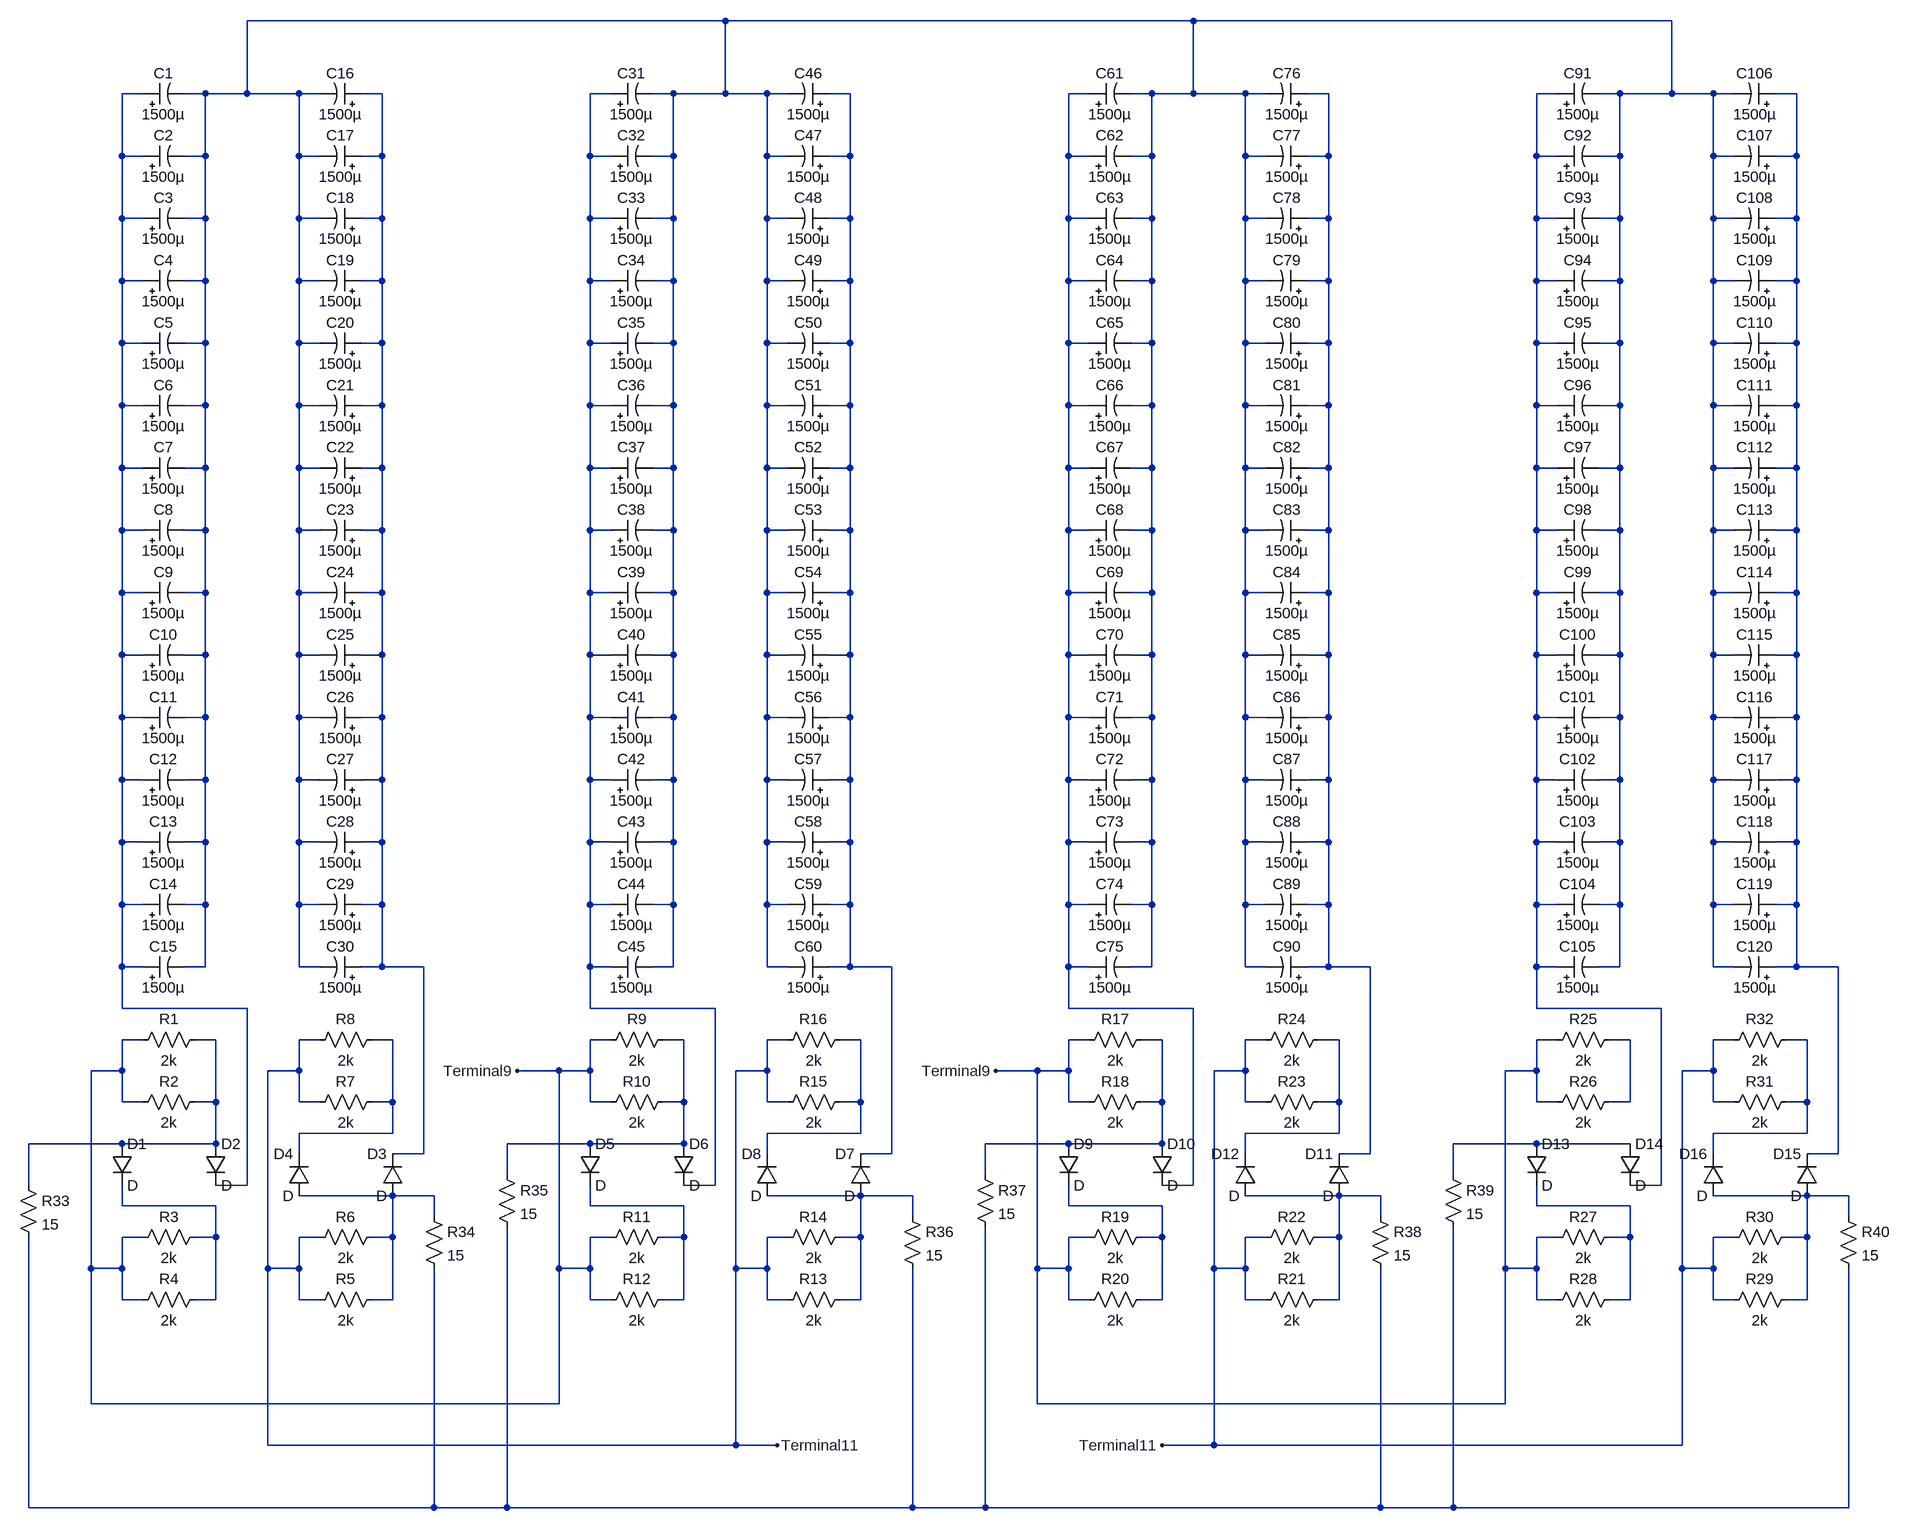
[diagram p0: schematic CapBank1_15CapSide_1to1.asc]
CapBank1_15CapSide_1to1.asc, the LTspice schematic file:
Version 4
SHEET 1 2772 2280
WIRE 976 -16 240 -16
WIRE 1696 -16 976 -16
WIRE 2432 -16 1696 -16
WIRE 80 96 48 96
WIRE 176 96 144 96
WIRE 240 96 240 -16
WIRE 240 96 176 96
WIRE 320 96 240 96
WIRE 352 96 320 96
WIRE 448 96 416 96
WIRE 800 96 768 96
WIRE 896 96 864 96
WIRE 976 96 976 -16
WIRE 976 96 896 96
WIRE 1040 96 976 96
WIRE 1072 96 1040 96
WIRE 1168 96 1136 96
WIRE 1536 96 1504 96
WIRE 1632 96 1600 96
WIRE 1696 96 1696 -16
WIRE 1696 96 1632 96
WIRE 1776 96 1696 96
WIRE 1808 96 1776 96
WIRE 1904 96 1872 96
WIRE 2256 96 2224 96
WIRE 2352 96 2320 96
WIRE 2432 96 2432 -16
WIRE 2432 96 2352 96
WIRE 2496 96 2432 96
WIRE 2528 96 2496 96
WIRE 2624 96 2592 96
WIRE 48 192 48 96
WIRE 80 192 48 192
WIRE 176 192 176 96
WIRE 176 192 144 192
WIRE 320 192 320 96
WIRE 352 192 320 192
WIRE 448 192 448 96
WIRE 448 192 416 192
WIRE 768 192 768 96
WIRE 800 192 768 192
WIRE 896 192 896 96
WIRE 896 192 864 192
WIRE 1040 192 1040 96
WIRE 1072 192 1040 192
WIRE 1168 192 1168 96
WIRE 1168 192 1136 192
WIRE 1504 192 1504 96
WIRE 1536 192 1504 192
WIRE 1632 192 1632 96
WIRE 1632 192 1600 192
WIRE 1776 192 1776 96
WIRE 1808 192 1776 192
WIRE 1904 192 1904 96
WIRE 1904 192 1872 192
WIRE 2224 192 2224 96
WIRE 2256 192 2224 192
WIRE 2352 192 2352 96
WIRE 2352 192 2320 192
WIRE 2496 192 2496 96
WIRE 2528 192 2496 192
WIRE 2624 192 2624 96
WIRE 2624 192 2592 192
WIRE 48 288 48 192
WIRE 80 288 48 288
WIRE 176 288 176 192
WIRE 176 288 144 288
WIRE 320 288 320 192
WIRE 352 288 320 288
WIRE 448 288 448 192
WIRE 448 288 416 288
WIRE 768 288 768 192
WIRE 800 288 768 288
WIRE 896 288 896 192
WIRE 896 288 864 288
WIRE 1040 288 1040 192
WIRE 1072 288 1040 288
WIRE 1168 288 1168 192
WIRE 1168 288 1136 288
WIRE 1504 288 1504 192
WIRE 1536 288 1504 288
WIRE 1632 288 1632 192
WIRE 1632 288 1600 288
WIRE 1776 288 1776 192
WIRE 1808 288 1776 288
WIRE 1904 288 1904 192
WIRE 1904 288 1872 288
WIRE 2224 288 2224 192
WIRE 2256 288 2224 288
WIRE 2352 288 2352 192
WIRE 2352 288 2320 288
WIRE 2496 288 2496 192
WIRE 2528 288 2496 288
WIRE 2624 288 2624 192
WIRE 2624 288 2592 288
WIRE 48 384 48 288
WIRE 80 384 48 384
WIRE 176 384 176 288
WIRE 176 384 144 384
WIRE 320 384 320 288
WIRE 352 384 320 384
WIRE 448 384 448 288
WIRE 448 384 416 384
WIRE 768 384 768 288
WIRE 800 384 768 384
WIRE 896 384 896 288
WIRE 896 384 864 384
WIRE 1040 384 1040 288
WIRE 1072 384 1040 384
WIRE 1168 384 1168 288
WIRE 1168 384 1136 384
WIRE 1504 384 1504 288
WIRE 1536 384 1504 384
WIRE 1632 384 1632 288
WIRE 1632 384 1600 384
WIRE 1776 384 1776 288
WIRE 1808 384 1776 384
WIRE 1904 384 1904 288
WIRE 1904 384 1872 384
WIRE 2224 384 2224 288
WIRE 2256 384 2224 384
WIRE 2352 384 2352 288
WIRE 2352 384 2320 384
WIRE 2496 384 2496 288
WIRE 2528 384 2496 384
WIRE 2624 384 2624 288
WIRE 2624 384 2592 384
WIRE 48 480 48 384
WIRE 80 480 48 480
WIRE 176 480 176 384
WIRE 176 480 144 480
WIRE 320 480 320 384
WIRE 352 480 320 480
WIRE 448 480 448 384
WIRE 448 480 416 480
WIRE 768 480 768 384
WIRE 800 480 768 480
WIRE 896 480 896 384
WIRE 896 480 864 480
WIRE 1040 480 1040 384
WIRE 1072 480 1040 480
WIRE 1168 480 1168 384
WIRE 1168 480 1136 480
WIRE 1504 480 1504 384
WIRE 1536 480 1504 480
WIRE 1632 480 1632 384
WIRE 1632 480 1600 480
WIRE 1776 480 1776 384
WIRE 1808 480 1776 480
WIRE 1904 480 1904 384
WIRE 1904 480 1872 480
WIRE 2224 480 2224 384
WIRE 2256 480 2224 480
WIRE 2352 480 2352 384
WIRE 2352 480 2320 480
WIRE 2496 480 2496 384
WIRE 2528 480 2496 480
WIRE 2624 480 2624 384
WIRE 2624 480 2592 480
WIRE 48 576 48 480
WIRE 80 576 48 576
WIRE 176 576 176 480
WIRE 176 576 144 576
WIRE 320 576 320 480
WIRE 352 576 320 576
WIRE 448 576 448 480
WIRE 448 576 416 576
WIRE 768 576 768 480
WIRE 800 576 768 576
WIRE 896 576 896 480
WIRE 896 576 864 576
WIRE 1040 576 1040 480
WIRE 1072 576 1040 576
WIRE 1168 576 1168 480
WIRE 1168 576 1136 576
WIRE 1504 576 1504 480
WIRE 1536 576 1504 576
WIRE 1632 576 1632 480
WIRE 1632 576 1600 576
WIRE 1776 576 1776 480
WIRE 1808 576 1776 576
WIRE 1904 576 1904 480
WIRE 1904 576 1872 576
WIRE 2224 576 2224 480
WIRE 2256 576 2224 576
WIRE 2352 576 2352 480
WIRE 2352 576 2320 576
WIRE 2496 576 2496 480
WIRE 2528 576 2496 576
WIRE 2624 576 2624 480
WIRE 2624 576 2592 576
WIRE 48 672 48 576
WIRE 80 672 48 672
WIRE 176 672 176 576
WIRE 176 672 144 672
WIRE 320 672 320 576
WIRE 352 672 320 672
WIRE 448 672 448 576
WIRE 448 672 416 672
WIRE 768 672 768 576
WIRE 800 672 768 672
WIRE 896 672 896 576
WIRE 896 672 864 672
WIRE 1040 672 1040 576
WIRE 1072 672 1040 672
WIRE 1168 672 1168 576
WIRE 1168 672 1136 672
WIRE 1504 672 1504 576
WIRE 1536 672 1504 672
WIRE 1632 672 1632 576
WIRE 1632 672 1600 672
WIRE 1776 672 1776 576
WIRE 1808 672 1776 672
WIRE 1904 672 1904 576
WIRE 1904 672 1872 672
WIRE 2224 672 2224 576
WIRE 2256 672 2224 672
WIRE 2352 672 2352 576
WIRE 2352 672 2320 672
WIRE 2496 672 2496 576
WIRE 2528 672 2496 672
WIRE 2624 672 2624 576
WIRE 2624 672 2592 672
WIRE 48 768 48 672
WIRE 80 768 48 768
WIRE 176 768 176 672
WIRE 176 768 144 768
WIRE 320 768 320 672
WIRE 352 768 320 768
WIRE 448 768 448 672
WIRE 448 768 416 768
WIRE 768 768 768 672
WIRE 800 768 768 768
WIRE 896 768 896 672
WIRE 896 768 864 768
WIRE 1040 768 1040 672
WIRE 1072 768 1040 768
WIRE 1168 768 1168 672
WIRE 1168 768 1136 768
WIRE 1504 768 1504 672
WIRE 1536 768 1504 768
WIRE 1632 768 1632 672
WIRE 1632 768 1600 768
WIRE 1776 768 1776 672
WIRE 1808 768 1776 768
WIRE 1904 768 1904 672
WIRE 1904 768 1872 768
WIRE 2224 768 2224 672
WIRE 2256 768 2224 768
WIRE 2352 768 2352 672
WIRE 2352 768 2320 768
WIRE 2496 768 2496 672
WIRE 2528 768 2496 768
WIRE 2624 768 2624 672
WIRE 2624 768 2592 768
WIRE 48 864 48 768
WIRE 80 864 48 864
WIRE 176 864 176 768
WIRE 176 864 144 864
WIRE 320 864 320 768
WIRE 352 864 320 864
WIRE 448 864 448 768
WIRE 448 864 416 864
WIRE 768 864 768 768
WIRE 800 864 768 864
WIRE 896 864 896 768
WIRE 896 864 864 864
WIRE 1040 864 1040 768
WIRE 1072 864 1040 864
WIRE 1168 864 1168 768
WIRE 1168 864 1136 864
WIRE 1504 864 1504 768
WIRE 1536 864 1504 864
WIRE 1632 864 1632 768
WIRE 1632 864 1600 864
WIRE 1776 864 1776 768
WIRE 1808 864 1776 864
WIRE 1904 864 1904 768
WIRE 1904 864 1872 864
WIRE 2224 864 2224 768
WIRE 2256 864 2224 864
WIRE 2352 864 2352 768
WIRE 2352 864 2320 864
WIRE 2496 864 2496 768
WIRE 2528 864 2496 864
WIRE 2624 864 2624 768
WIRE 2624 864 2592 864
WIRE 48 960 48 864
WIRE 80 960 48 960
WIRE 176 960 176 864
WIRE 176 960 144 960
WIRE 320 960 320 864
WIRE 352 960 320 960
WIRE 448 960 448 864
WIRE 448 960 416 960
WIRE 768 960 768 864
WIRE 800 960 768 960
WIRE 896 960 896 864
WIRE 896 960 864 960
WIRE 1040 960 1040 864
WIRE 1072 960 1040 960
WIRE 1168 960 1168 864
WIRE 1168 960 1136 960
WIRE 1504 960 1504 864
WIRE 1536 960 1504 960
WIRE 1632 960 1632 864
WIRE 1632 960 1600 960
WIRE 1776 960 1776 864
WIRE 1808 960 1776 960
WIRE 1904 960 1904 864
WIRE 1904 960 1872 960
WIRE 2224 960 2224 864
WIRE 2256 960 2224 960
WIRE 2352 960 2352 864
WIRE 2352 960 2320 960
WIRE 2496 960 2496 864
WIRE 2528 960 2496 960
WIRE 2624 960 2624 864
WIRE 2624 960 2592 960
WIRE 48 1056 48 960
WIRE 80 1056 48 1056
WIRE 176 1056 176 960
WIRE 176 1056 144 1056
WIRE 320 1056 320 960
WIRE 352 1056 320 1056
WIRE 448 1056 448 960
WIRE 448 1056 416 1056
WIRE 768 1056 768 960
WIRE 800 1056 768 1056
WIRE 896 1056 896 960
WIRE 896 1056 864 1056
WIRE 1040 1056 1040 960
WIRE 1072 1056 1040 1056
WIRE 1168 1056 1168 960
WIRE 1168 1056 1136 1056
WIRE 1504 1056 1504 960
WIRE 1536 1056 1504 1056
WIRE 1632 1056 1632 960
WIRE 1632 1056 1600 1056
WIRE 1776 1056 1776 960
WIRE 1808 1056 1776 1056
WIRE 1904 1056 1904 960
WIRE 1904 1056 1872 1056
WIRE 2224 1056 2224 960
WIRE 2256 1056 2224 1056
WIRE 2352 1056 2352 960
WIRE 2352 1056 2320 1056
WIRE 2496 1056 2496 960
WIRE 2528 1056 2496 1056
WIRE 2624 1056 2624 960
WIRE 2624 1056 2592 1056
WIRE 48 1152 48 1056
WIRE 80 1152 48 1152
WIRE 176 1152 176 1056
WIRE 176 1152 144 1152
WIRE 320 1152 320 1056
WIRE 352 1152 320 1152
WIRE 448 1152 448 1056
WIRE 448 1152 416 1152
WIRE 768 1152 768 1056
WIRE 800 1152 768 1152
WIRE 896 1152 896 1056
WIRE 896 1152 864 1152
WIRE 1040 1152 1040 1056
WIRE 1072 1152 1040 1152
WIRE 1168 1152 1168 1056
WIRE 1168 1152 1136 1152
WIRE 1504 1152 1504 1056
WIRE 1536 1152 1504 1152
WIRE 1632 1152 1632 1056
WIRE 1632 1152 1600 1152
WIRE 1776 1152 1776 1056
WIRE 1808 1152 1776 1152
WIRE 1904 1152 1904 1056
WIRE 1904 1152 1872 1152
WIRE 2224 1152 2224 1056
WIRE 2256 1152 2224 1152
WIRE 2352 1152 2352 1056
WIRE 2352 1152 2320 1152
WIRE 2496 1152 2496 1056
WIRE 2528 1152 2496 1152
WIRE 2624 1152 2624 1056
WIRE 2624 1152 2592 1152
WIRE 48 1248 48 1152
WIRE 80 1248 48 1248
WIRE 176 1248 176 1152
WIRE 176 1248 144 1248
WIRE 320 1248 320 1152
WIRE 352 1248 320 1248
WIRE 448 1248 448 1152
WIRE 448 1248 416 1248
WIRE 768 1248 768 1152
WIRE 800 1248 768 1248
WIRE 896 1248 896 1152
WIRE 896 1248 864 1248
WIRE 1040 1248 1040 1152
WIRE 1072 1248 1040 1248
WIRE 1168 1248 1168 1152
WIRE 1168 1248 1136 1248
WIRE 1504 1248 1504 1152
WIRE 1536 1248 1504 1248
WIRE 1632 1248 1632 1152
WIRE 1632 1248 1600 1248
WIRE 1776 1248 1776 1152
WIRE 1808 1248 1776 1248
WIRE 1904 1248 1904 1152
WIRE 1904 1248 1872 1248
WIRE 2224 1248 2224 1152
WIRE 2256 1248 2224 1248
WIRE 2352 1248 2352 1152
WIRE 2352 1248 2320 1248
WIRE 2496 1248 2496 1152
WIRE 2528 1248 2496 1248
WIRE 2624 1248 2624 1152
WIRE 2624 1248 2592 1248
WIRE 48 1344 48 1248
WIRE 80 1344 48 1344
WIRE 176 1344 176 1248
WIRE 176 1344 144 1344
WIRE 320 1344 320 1248
WIRE 352 1344 320 1344
WIRE 448 1344 448 1248
WIRE 448 1344 416 1344
WIRE 768 1344 768 1248
WIRE 800 1344 768 1344
WIRE 896 1344 896 1248
WIRE 896 1344 864 1344
WIRE 1040 1344 1040 1248
WIRE 1072 1344 1040 1344
WIRE 1168 1344 1168 1248
WIRE 1168 1344 1136 1344
WIRE 1504 1344 1504 1248
WIRE 1536 1344 1504 1344
WIRE 1632 1344 1632 1248
WIRE 1632 1344 1600 1344
WIRE 1776 1344 1776 1248
WIRE 1808 1344 1776 1344
WIRE 1904 1344 1904 1248
WIRE 1904 1344 1872 1344
WIRE 2224 1344 2224 1248
WIRE 2256 1344 2224 1344
WIRE 2352 1344 2352 1248
WIRE 2352 1344 2320 1344
WIRE 2496 1344 2496 1248
WIRE 2528 1344 2496 1344
WIRE 2624 1344 2624 1248
WIRE 2624 1344 2592 1344
WIRE 48 1440 48 1344
WIRE 80 1440 48 1440
WIRE 176 1440 176 1344
WIRE 176 1440 144 1440
WIRE 320 1440 320 1344
WIRE 352 1440 320 1440
WIRE 448 1440 448 1344
WIRE 448 1440 416 1440
WIRE 512 1440 448 1440
WIRE 768 1440 768 1344
WIRE 800 1440 768 1440
WIRE 896 1440 896 1344
WIRE 896 1440 864 1440
WIRE 1040 1440 1040 1344
WIRE 1072 1440 1040 1440
WIRE 1168 1440 1168 1344
WIRE 1168 1440 1136 1440
WIRE 1232 1440 1168 1440
WIRE 1504 1440 1504 1344
WIRE 1536 1440 1504 1440
WIRE 1632 1440 1632 1344
WIRE 1632 1440 1600 1440
WIRE 1776 1440 1776 1344
WIRE 1808 1440 1776 1440
WIRE 1904 1440 1904 1344
WIRE 1904 1440 1872 1440
WIRE 1968 1440 1904 1440
WIRE 2224 1440 2224 1344
WIRE 2256 1440 2224 1440
WIRE 2352 1440 2352 1344
WIRE 2352 1440 2320 1440
WIRE 2496 1440 2496 1344
WIRE 2528 1440 2496 1440
WIRE 2624 1440 2624 1344
WIRE 2624 1440 2592 1440
WIRE 2688 1440 2624 1440
WIRE 48 1504 48 1440
WIRE 240 1504 48 1504
WIRE 768 1504 768 1440
WIRE 960 1504 768 1504
WIRE 1504 1504 1504 1440
WIRE 1696 1504 1504 1504
WIRE 2224 1504 2224 1440
WIRE 2416 1504 2224 1504
WIRE 80 1552 48 1552
WIRE 192 1552 160 1552
WIRE 352 1552 320 1552
WIRE 464 1552 432 1552
WIRE 800 1552 768 1552
WIRE 912 1552 880 1552
WIRE 1072 1552 1040 1552
WIRE 1184 1552 1152 1552
WIRE 1536 1552 1504 1552
WIRE 1648 1552 1616 1552
WIRE 1808 1552 1776 1552
WIRE 1920 1552 1888 1552
WIRE 2256 1552 2224 1552
WIRE 2368 1552 2336 1552
WIRE 2528 1552 2496 1552
WIRE 2640 1552 2608 1552
WIRE 48 1600 48 1552
WIRE 48 1600 0 1600
WIRE 320 1600 320 1552
WIRE 320 1600 272 1600
WIRE 720 1600 656 1600
WIRE 768 1600 768 1552
WIRE 768 1600 720 1600
WIRE 1040 1600 1040 1552
WIRE 1040 1600 992 1600
WIRE 1456 1600 1392 1600
WIRE 1504 1600 1504 1552
WIRE 1504 1600 1456 1600
WIRE 1776 1600 1776 1552
WIRE 1776 1600 1728 1600
WIRE 2224 1600 2224 1552
WIRE 2224 1600 2176 1600
WIRE 2496 1600 2496 1552
WIRE 2496 1600 2448 1600
WIRE 48 1648 48 1600
WIRE 80 1648 48 1648
WIRE 192 1648 192 1552
WIRE 192 1648 160 1648
WIRE 320 1648 320 1600
WIRE 352 1648 320 1648
WIRE 464 1648 464 1552
WIRE 464 1648 432 1648
WIRE 768 1648 768 1600
WIRE 800 1648 768 1648
WIRE 912 1648 912 1552
WIRE 912 1648 880 1648
WIRE 1040 1648 1040 1600
WIRE 1072 1648 1040 1648
WIRE 1184 1648 1184 1552
WIRE 1184 1648 1152 1648
WIRE 1504 1648 1504 1600
WIRE 1536 1648 1504 1648
WIRE 1648 1648 1648 1552
WIRE 1648 1648 1616 1648
WIRE 1776 1648 1776 1600
WIRE 1808 1648 1776 1648
WIRE 1920 1648 1920 1552
WIRE 1920 1648 1888 1648
WIRE 2224 1648 2224 1600
WIRE 2256 1648 2224 1648
WIRE 2368 1648 2368 1552
WIRE 2368 1648 2336 1648
WIRE 2496 1648 2496 1600
WIRE 2528 1648 2496 1648
WIRE 2640 1648 2640 1552
WIRE 2640 1648 2608 1648
WIRE 464 1696 464 1648
WIRE 464 1696 320 1696
WIRE 1184 1696 1184 1648
WIRE 1184 1696 1040 1696
WIRE 1920 1696 1920 1648
WIRE 1920 1696 1776 1696
WIRE 2640 1696 2640 1648
WIRE 2640 1696 2496 1696
WIRE 48 1712 -96 1712
WIRE 192 1712 192 1648
WIRE 192 1712 48 1712
WIRE 768 1712 640 1712
WIRE 912 1712 912 1648
WIRE 912 1712 768 1712
WIRE 1504 1712 1376 1712
WIRE 1648 1712 1648 1648
WIRE 1648 1712 1504 1712
WIRE 2224 1712 2096 1712
WIRE 2368 1712 2224 1712
WIRE 320 1728 320 1696
WIRE 512 1728 512 1440
WIRE 512 1728 464 1728
WIRE 1040 1728 1040 1696
WIRE 1232 1728 1232 1440
WIRE 1232 1728 1184 1728
WIRE 1776 1728 1776 1696
WIRE 1968 1728 1968 1440
WIRE 1968 1728 1920 1728
WIRE 2496 1728 2496 1696
WIRE 2688 1728 2688 1440
WIRE 2688 1728 2640 1728
WIRE 640 1760 640 1712
WIRE 1376 1760 1376 1712
WIRE 2096 1760 2096 1712
WIRE -96 1776 -96 1712
WIRE 240 1776 240 1504
WIRE 240 1776 192 1776
WIRE 960 1776 960 1504
WIRE 960 1776 912 1776
WIRE 1696 1776 1696 1504
WIRE 1696 1776 1648 1776
WIRE 2416 1776 2416 1504
WIRE 2416 1776 2368 1776
WIRE 464 1792 320 1792
WIRE 528 1792 464 1792
WIRE 1184 1792 1040 1792
WIRE 1264 1792 1184 1792
WIRE 1920 1792 1776 1792
WIRE 1984 1792 1920 1792
WIRE 2640 1792 2496 1792
WIRE 2704 1792 2640 1792
WIRE 48 1808 48 1776
WIRE 192 1808 48 1808
WIRE 768 1808 768 1776
WIRE 912 1808 768 1808
WIRE 1504 1808 1504 1776
WIRE 1648 1808 1504 1808
WIRE 2224 1808 2224 1776
WIRE 2368 1808 2224 1808
WIRE 528 1824 528 1792
WIRE 1264 1824 1264 1792
WIRE 1984 1824 1984 1792
WIRE 2704 1824 2704 1792
WIRE 80 1856 48 1856
WIRE 192 1856 192 1808
WIRE 192 1856 160 1856
WIRE 352 1856 320 1856
WIRE 464 1856 464 1792
WIRE 464 1856 432 1856
WIRE 800 1856 768 1856
WIRE 912 1856 912 1808
WIRE 912 1856 880 1856
WIRE 1072 1856 1040 1856
WIRE 1184 1856 1184 1792
WIRE 1184 1856 1152 1856
WIRE 1536 1856 1504 1856
WIRE 1648 1856 1648 1808
WIRE 1648 1856 1616 1856
WIRE 1808 1856 1776 1856
WIRE 1920 1856 1920 1792
WIRE 1920 1856 1888 1856
WIRE 2256 1856 2224 1856
WIRE 2368 1856 2368 1808
WIRE 2368 1856 2336 1856
WIRE 2528 1856 2496 1856
WIRE 2640 1856 2640 1792
WIRE 2640 1856 2608 1856
WIRE 0 1904 0 1600
WIRE 48 1904 48 1856
WIRE 48 1904 0 1904
WIRE 272 1904 272 1600
WIRE 320 1904 320 1856
WIRE 320 1904 272 1904
WIRE 720 1904 720 1600
WIRE 768 1904 768 1856
WIRE 768 1904 720 1904
WIRE 992 1904 992 1600
WIRE 1040 1904 1040 1856
WIRE 1040 1904 992 1904
WIRE 1456 1904 1456 1600
WIRE 1504 1904 1504 1856
WIRE 1504 1904 1456 1904
WIRE 1728 1904 1728 1600
WIRE 1776 1904 1776 1856
WIRE 1776 1904 1728 1904
WIRE 2176 1904 2176 1600
WIRE 2224 1904 2224 1856
WIRE 2224 1904 2176 1904
WIRE 2448 1904 2448 1600
WIRE 2496 1904 2496 1856
WIRE 2496 1904 2448 1904
WIRE 48 1952 48 1904
WIRE 80 1952 48 1952
WIRE 192 1952 192 1856
WIRE 192 1952 160 1952
WIRE 320 1952 320 1904
WIRE 352 1952 320 1952
WIRE 464 1952 464 1856
WIRE 464 1952 432 1952
WIRE 768 1952 768 1904
WIRE 800 1952 768 1952
WIRE 912 1952 912 1856
WIRE 912 1952 880 1952
WIRE 1040 1952 1040 1904
WIRE 1072 1952 1040 1952
WIRE 1184 1952 1184 1856
WIRE 1184 1952 1152 1952
WIRE 1504 1952 1504 1904
WIRE 1536 1952 1504 1952
WIRE 1648 1952 1648 1856
WIRE 1648 1952 1616 1952
WIRE 1776 1952 1776 1904
WIRE 1808 1952 1776 1952
WIRE 1920 1952 1920 1856
WIRE 1920 1952 1888 1952
WIRE 2224 1952 2224 1904
WIRE 2256 1952 2224 1952
WIRE 2368 1952 2368 1856
WIRE 2368 1952 2336 1952
WIRE 2496 1952 2496 1904
WIRE 2528 1952 2496 1952
WIRE 2640 1952 2640 1856
WIRE 2640 1952 2608 1952
WIRE 0 2112 0 1904
WIRE 720 2112 720 1904
WIRE 720 2112 0 2112
WIRE 1456 2112 1456 1904
WIRE 2176 2112 2176 1904
WIRE 2176 2112 1456 2112
WIRE 272 2176 272 1904
WIRE 992 2176 992 1904
WIRE 992 2176 272 2176
WIRE 1056 2176 992 2176
WIRE 1728 2176 1728 1904
WIRE 1728 2176 1648 2176
WIRE 2448 2176 2448 1904
WIRE 2448 2176 1728 2176
WIRE -96 2272 -96 1856
WIRE 528 2272 528 1904
WIRE 528 2272 -96 2272
WIRE 640 2272 640 1840
WIRE 640 2272 528 2272
WIRE 1264 2272 1264 1904
WIRE 1264 2272 640 2272
WIRE 1376 2272 1376 1840
WIRE 1376 2272 1264 2272
WIRE 1984 2272 1984 1904
WIRE 1984 2272 1376 2272
WIRE 2096 2272 2096 1840
WIRE 2096 2272 1984 2272
WIRE 2704 2272 2704 1904
WIRE 2704 2272 2096 2272
FLAG 656 1600 Terminal9
FLAG 1056 2176 Terminal11
FLAG 1392 1600 Terminal9
FLAG 1648 2176 Terminal11
SYMBOL polcap 80 112 R270
WINDOW 0 32 32 VTop 2
WINDOW 3 0 32 VBottom 2
SYMATTR InstName C1
SYMATTR Value 1500µ
SYMBOL polcap 80 208 R270
WINDOW 0 32 32 VTop 2
WINDOW 3 0 32 VBottom 2
SYMATTR InstName C2
SYMATTR Value 1500µ
SYMBOL polcap 80 304 R270
WINDOW 0 32 32 VTop 2
WINDOW 3 0 32 VBottom 2
SYMATTR InstName C3
SYMATTR Value 1500µ
SYMBOL polcap 80 400 R270
WINDOW 0 32 32 VTop 2
WINDOW 3 0 32 VBottom 2
SYMATTR InstName C4
SYMATTR Value 1500µ
SYMBOL polcap 80 496 R270
WINDOW 0 32 32 VTop 2
WINDOW 3 0 32 VBottom 2
SYMATTR InstName C5
SYMATTR Value 1500µ
SYMBOL polcap 80 592 R270
WINDOW 0 32 32 VTop 2
WINDOW 3 0 32 VBottom 2
SYMATTR InstName C6
SYMATTR Value 1500µ
SYMBOL polcap 80 688 R270
WINDOW 0 32 32 VTop 2
WINDOW 3 0 32 VBottom 2
SYMATTR InstName C7
SYMATTR Value 1500µ
SYMBOL polcap 80 784 R270
WINDOW 0 32 32 VTop 2
WINDOW 3 0 32 VBottom 2
SYMATTR InstName C8
SYMATTR Value 1500µ
SYMBOL polcap 80 880 R270
WINDOW 0 32 32 VTop 2
WINDOW 3 0 32 VBottom 2
SYMATTR InstName C9
SYMATTR Value 1500µ
SYMBOL polcap 80 976 R270
WINDOW 0 32 32 VTop 2
WINDOW 3 0 32 VBottom 2
SYMATTR InstName C10
SYMATTR Value 1500µ
SYMBOL polcap 80 1072 R270
WINDOW 0 32 32 VTop 2
WINDOW 3 0 32 VBottom 2
SYMATTR InstName C11
SYMATTR Value 1500µ
SYMBOL polcap 80 1168 R270
WINDOW 0 32 32 VTop 2
WINDOW 3 0 32 VBottom 2
SYMATTR InstName C12
SYMATTR Value 1500µ
SYMBOL polcap 80 1264 R270
WINDOW 0 32 32 VTop 2
WINDOW 3 0 32 VBottom 2
SYMATTR InstName C13
SYMATTR Value 1500µ
SYMBOL polcap 80 1360 R270
WINDOW 0 32 32 VTop 2
WINDOW 3 0 32 VBottom 2
SYMATTR InstName C14
SYMATTR Value 1500µ
SYMBOL polcap 80 1456 R270
WINDOW 0 32 32 VTop 2
WINDOW 3 0 32 VBottom 2
SYMATTR InstName C15
SYMATTR Value 1500µ
SYMBOL polcap 416 112 M270
WINDOW 0 32 32 VTop 2
WINDOW 3 0 32 VBottom 2
SYMATTR InstName C16
SYMATTR Value 1500µ
SYMBOL polcap 416 208 M270
WINDOW 0 32 32 VTop 2
WINDOW 3 0 32 VBottom 2
SYMATTR InstName C17
SYMATTR Value 1500µ
SYMBOL polcap 416 304 M270
WINDOW 0 32 32 VTop 2
WINDOW 3 0 32 VBottom 2
SYMATTR InstName C18
SYMATTR Value 1500µ
SYMBOL polcap 416 400 M270
WINDOW 0 32 32 VTop 2
WINDOW 3 0 32 VBottom 2
SYMATTR InstName C19
SYMATTR Value 1500µ
SYMBOL polcap 416 496 M270
WINDOW 0 32 32 VTop 2
WINDOW 3 0 32 VBottom 2
SYMATTR InstName C20
SYMATTR Value 1500µ
SYMBOL polcap 416 592 M270
WINDOW 0 32 32 VTop 2
WINDOW 3 0 32 VBottom 2
SYMATTR InstName C21
SYMATTR Value 1500µ
SYMBOL polcap 416 688 M270
WINDOW 0 32 32 VTop 2
WINDOW 3 0 32 VBottom 2
SYMATTR InstName C22
SYMATTR Value 1500µ
SYMBOL polcap 416 784 M270
WINDOW 0 32 32 VTop 2
WINDOW 3 0 32 VBottom 2
SYMATTR InstName C23
SYMATTR Value 1500µ
SYMBOL polcap 416 880 M270
WINDOW 0 32 32 VTop 2
WINDOW 3 0 32 VBottom 2
SYMATTR InstName C24
SYMATTR Value 1500µ
SYMBOL polcap 416 976 M270
WINDOW 0 32 32 VTop 2
WINDOW 3 0 32 VBottom 2
SYMATTR InstName C25
SYMATTR Value 1500µ
SYMBOL polcap 416 1072 M270
WINDOW 0 32 32 VTop 2
WINDOW 3 0 32 VBottom 2
SYMATTR InstName C26
SYMATTR Value 1500µ
SYMBOL polcap 416 1168 M270
WINDOW 0 32 32 VTop 2
WINDOW 3 0 32 VBottom 2
SYMATTR InstName C27
SYMATTR Value 1500µ
SYMBOL polcap 416 1264 M270
WINDOW 0 32 32 VTop 2
WINDOW 3 0 32 VBottom 2
SYMATTR InstName C28
SYMATTR Value 1500µ
SYMBOL polcap 416 1360 M270
WINDOW 0 32 32 VTop 2
WINDOW 3 0 32 VBottom 2
SYMATTR InstName C29
SYMATTR Value 1500µ
SYMBOL polcap 416 1456 M270
WINDOW 0 32 32 VTop 2
WINDOW 3 0 32 VBottom 2
SYMATTR InstName C30
SYMATTR Value 1500µ
SYMBOL Res 176 1536 R90
WINDOW 0 0 56 VBottom 2
WINDOW 3 32 56 VTop 2
SYMATTR InstName R1
SYMATTR Value 2k
SYMBOL Res 176 1632 R90
WINDOW 0 0 56 VBottom 2
WINDOW 3 32 56 VTop 2
SYMATTR InstName R2
SYMATTR Value 2k
SYMBOL Diode 32 1712 R0
SYMATTR InstName D1
SYMBOL Diode 176 1712 R0
SYMATTR InstName D2
SYMBOL Res 176 1840 R90
WINDOW 0 0 56 VBottom 2
WINDOW 3 32 56 VTop 2
SYMATTR InstName R3
SYMATTR Value 2k
SYMBOL Res 176 1936 R90
WINDOW 0 0 56 VBottom 2
WINDOW 3 32 56 VTop 2
SYMATTR InstName R4
SYMATTR Value 2k
SYMBOL Res 336 1968 R270
WINDOW 0 32 56 VTop 2
WINDOW 3 0 56 VBottom 2
SYMATTR InstName R5
SYMATTR Value 2k
SYMBOL Res 336 1872 R270
WINDOW 0 32 56 VTop 2
WINDOW 3 0 56 VBottom 2
SYMATTR InstName R6
SYMATTR Value 2k
SYMBOL Diode 480 1792 R180
WINDOW 0 24 64 Left 2
WINDOW 3 24 0 Left 2
SYMATTR InstName D3
SYMBOL Diode 336 1792 R180
WINDOW 0 24 64 Left 2
WINDOW 3 24 0 Left 2
SYMATTR InstName D4
SYMBOL Res 336 1664 R270
WINDOW 0 32 56 VTop 2
WINDOW 3 0 56 VBottom 2
SYMATTR InstName R7
SYMATTR Value 2k
SYMBOL Res 336 1568 R270
WINDOW 0 32 56 VTop 2
WINDOW 3 0 56 VBottom 2
SYMATTR InstName R8
SYMATTR Value 2k
SYMBOL polcap 800 112 R270
WINDOW 0 32 32 VTop 2
WINDOW 3 0 32 VBottom 2
SYMATTR InstName C31
SYMATTR Value 1500µ
SYMBOL polcap 800 208 R270
WINDOW 0 32 32 VTop 2
WINDOW 3 0 32 VBottom 2
SYMATTR InstName C32
SYMATTR Value 1500µ
SYMBOL polcap 800 304 R270
WINDOW 0 32 32 VTop 2
WINDOW 3 0 32 VBottom 2
SYMATTR InstName C33
SYMATTR Value 1500µ
SYMBOL polcap 800 400 R270
WINDOW 0 32 32 VTop 2
WINDOW 3 0 32 VBottom 2
SYMATTR InstName C34
SYMATTR Value 1500µ
SYMBOL polcap 800 496 R270
WINDOW 0 32 32 VTop 2
WINDOW 3 0 32 VBottom 2
SYMATTR InstName C35
SYMATTR Value 1500µ
SYMBOL polcap 800 592 R270
WINDOW 0 32 32 VTop 2
WINDOW 3 0 32 VBottom 2
SYMATTR InstName C36
SYMATTR Value 1500µ
SYMBOL polcap 800 688 R270
WINDOW 0 32 32 VTop 2
WINDOW 3 0 32 VBottom 2
SYMATTR InstName C37
SYMATTR Value 1500µ
SYMBOL polcap 800 784 R270
WINDOW 0 32 32 VTop 2
WINDOW 3 0 32 VBottom 2
SYMATTR InstName C38
SYMATTR Value 1500µ
SYMBOL polcap 800 880 R270
WINDOW 0 32 32 VTop 2
WINDOW 3 0 32 VBottom 2
SYMATTR InstName C39
SYMATTR Value 1500µ
SYMBOL polcap 800 976 R270
WINDOW 0 32 32 VTop 2
WINDOW 3 0 32 VBottom 2
SYMATTR InstName C40
SYMATTR Value 1500µ
SYMBOL polcap 800 1072 R270
WINDOW 0 32 32 VTop 2
WINDOW 3 0 32 VBottom 2
SYMATTR InstName C41
SYMATTR Value 1500µ
SYMBOL polcap 800 1168 R270
WINDOW 0 32 32 VTop 2
WINDOW 3 0 32 VBottom 2
SYMATTR InstName C42
SYMATTR Value 1500µ
SYMBOL polcap 800 1264 R270
WINDOW 0 32 32 VTop 2
WINDOW 3 0 32 VBottom 2
SYMATTR InstName C43
SYMATTR Value 1500µ
SYMBOL polcap 800 1360 R270
WINDOW 0 32 32 VTop 2
WINDOW 3 0 32 VBottom 2
SYMATTR InstName C44
SYMATTR Value 1500µ
SYMBOL polcap 800 1456 R270
WINDOW 0 32 32 VTop 2
WINDOW 3 0 32 VBottom 2
SYMATTR InstName C45
SYMATTR Value 1500µ
SYMBOL polcap 1136 112 M270
WINDOW 0 32 32 VTop 2
WINDOW 3 0 32 VBottom 2
SYMATTR InstName C46
SYMATTR Value 1500µ
SYMBOL polcap 1136 208 M270
WINDOW 0 32 32 VTop 2
WINDOW 3 0 32 VBottom 2
SYMATTR InstName C47
SYMATTR Value 1500µ
SYMBOL polcap 1136 304 M270
WINDOW 0 32 32 VTop 2
WINDOW 3 0 32 VBottom 2
SYMATTR InstName C48
SYMATTR Value 1500µ
SYMBOL polcap 1136 400 M270
WINDOW 0 32 32 VTop 2
WINDOW 3 0 32 VBottom 2
SYMATTR InstName C49
SYMATTR Value 1500µ
SYMBOL polcap 1136 496 M270
WINDOW 0 32 32 VTop 2
WINDOW 3 0 32 VBottom 2
SYMATTR InstName C50
SYMATTR Value 1500µ
SYMBOL polcap 1136 592 M270
WINDOW 0 32 32 VTop 2
WINDOW 3 0 32 VBottom 2
SYMATTR InstName C51
SYMATTR Value 1500µ
SYMBOL polcap 1136 688 M270
WINDOW 0 32 32 VTop 2
WINDOW 3 0 32 VBottom 2
SYMATTR InstName C52
SYMATTR Value 1500µ
SYMBOL polcap 1136 784 M270
WINDOW 0 32 32 VTop 2
WINDOW 3 0 32 VBottom 2
SYMATTR InstName C53
SYMATTR Value 1500µ
SYMBOL polcap 1136 880 M270
WINDOW 0 32 32 VTop 2
WINDOW 3 0 32 VBottom 2
SYMATTR InstName C54
SYMATTR Value 1500µ
SYMBOL polcap 1136 976 M270
WINDOW 0 32 32 VTop 2
WINDOW 3 0 32 VBottom 2
SYMATTR InstName C55
SYMATTR Value 1500µ
SYMBOL polcap 1136 1072 M270
WINDOW 0 32 32 VTop 2
WINDOW 3 0 32 VBottom 2
SYMATTR InstName C56
SYMATTR Value 1500µ
SYMBOL polcap 1136 1168 M270
WINDOW 0 32 32 VTop 2
WINDOW 3 0 32 VBottom 2
SYMATTR InstName C57
SYMATTR Value 1500µ
SYMBOL polcap 1136 1264 M270
WINDOW 0 32 32 VTop 2
WINDOW 3 0 32 VBottom 2
SYMATTR InstName C58
SYMATTR Value 1500µ
SYMBOL polcap 1136 1360 M270
WINDOW 0 32 32 VTop 2
WINDOW 3 0 32 VBottom 2
SYMATTR InstName C59
SYMATTR Value 1500µ
SYMBOL polcap 1136 1456 M270
WINDOW 0 32 32 VTop 2
WINDOW 3 0 32 VBottom 2
SYMATTR InstName C60
SYMATTR Value 1500µ
SYMBOL Res 896 1536 R90
WINDOW 0 0 56 VBottom 2
WINDOW 3 32 56 VTop 2
SYMATTR InstName R9
SYMATTR Value 2k
SYMBOL Res 896 1632 R90
WINDOW 0 0 56 VBottom 2
WINDOW 3 32 56 VTop 2
SYMATTR InstName R10
SYMATTR Value 2k
SYMBOL Diode 752 1712 R0
SYMATTR InstName D5
SYMBOL Diode 896 1712 R0
SYMATTR InstName D6
SYMBOL Res 896 1840 R90
WINDOW 0 0 56 VBottom 2
WINDOW 3 32 56 VTop 2
SYMATTR InstName R11
SYMATTR Value 2k
SYMBOL Res 896 1936 R90
WINDOW 0 0 56 VBottom 2
WINDOW 3 32 56 VTop 2
SYMATTR InstName R12
SYMATTR Value 2k
SYMBOL Res 1056 1968 R270
WINDOW 0 32 56 VTop 2
WINDOW 3 0 56 VBottom 2
SYMATTR InstName R13
SYMATTR Value 2k
SYMBOL Res 1056 1872 R270
WINDOW 0 32 56 VTop 2
WINDOW 3 0 56 VBottom 2
SYMATTR InstName R14
SYMATTR Value 2k
SYMBOL Diode 1200 1792 R180
WINDOW 0 24 64 Left 2
WINDOW 3 24 0 Left 2
SYMATTR InstName D7
SYMBOL Diode 1056 1792 R180
WINDOW 0 24 64 Left 2
WINDOW 3 24 0 Left 2
SYMATTR InstName D8
SYMBOL Res 1056 1664 R270
WINDOW 0 32 56 VTop 2
WINDOW 3 0 56 VBottom 2
SYMATTR InstName R15
SYMATTR Value 2k
SYMBOL Res 1056 1568 R270
WINDOW 0 32 56 VTop 2
WINDOW 3 0 56 VBottom 2
SYMATTR InstName R16
SYMATTR Value 2k
SYMBOL polcap 1536 112 R270
WINDOW 0 32 32 VTop 2
WINDOW 3 0 32 VBottom 2
SYMATTR InstName C61
SYMATTR Value 1500µ
SYMBOL polcap 1536 208 R270
WINDOW 0 32 32 VTop 2
WINDOW 3 0 32 VBottom 2
SYMATTR InstName C62
SYMATTR Value 1500µ
SYMBOL polcap 1536 304 R270
WINDOW 0 32 32 VTop 2
WINDOW 3 0 32 VBottom 2
SYMATTR InstName C63
SYMATTR Value 1500µ
SYMBOL polcap 1536 400 R270
WINDOW 0 32 32 VTop 2
WINDOW 3 0 32 VBottom 2
SYMATTR InstName C64
SYMATTR Value 1500µ
SYMBOL polcap 1536 496 R270
WINDOW 0 32 32 VTop 2
WINDOW 3 0 32 VBottom 2
SYMATTR InstName C65
SYMATTR Value 1500µ
SYMBOL polcap 1536 592 R270
WINDOW 0 32 32 VTop 2
WINDOW 3 0 32 VBottom 2
SYMATTR InstName C66
SYMATTR Value 1500µ
SYMBOL polcap 1536 688 R270
WINDOW 0 32 32 VTop 2
WINDOW 3 0 32 VBottom 2
SYMATTR InstName C67
SYMATTR Value 1500µ
SYMBOL polcap 1536 784 R270
WINDOW 0 32 32 VTop 2
WINDOW 3 0 32 VBottom 2
SYMATTR InstName C68
SYMATTR Value 1500µ
SYMBOL polcap 1536 880 R270
WINDOW 0 32 32 VTop 2
WINDOW 3 0 32 VBottom 2
SYMATTR InstName C69
SYMATTR Value 1500µ
SYMBOL polcap 1536 976 R270
WINDOW 0 32 32 VTop 2
WINDOW 3 0 32 VBottom 2
SYMATTR InstName C70
SYMATTR Value 1500µ
SYMBOL polcap 1536 1072 R270
WINDOW 0 32 32 VTop 2
WINDOW 3 0 32 VBottom 2
SYMATTR InstName C71
SYMATTR Value 1500µ
SYMBOL polcap 1536 1168 R270
WINDOW 0 32 32 VTop 2
WINDOW 3 0 32 VBottom 2
SYMATTR InstName C72
SYMATTR Value 1500µ
SYMBOL polcap 1536 1264 R270
WINDOW 0 32 32 VTop 2
WINDOW 3 0 32 VBottom 2
SYMATTR InstName C73
SYMATTR Value 1500µ
SYMBOL polcap 1536 1360 R270
WINDOW 0 32 32 VTop 2
WINDOW 3 0 32 VBottom 2
SYMATTR InstName C74
SYMATTR Value 1500µ
SYMBOL polcap 1536 1456 R270
WINDOW 0 32 32 VTop 2
WINDOW 3 0 32 VBottom 2
SYMATTR InstName C75
SYMATTR Value 1500µ
SYMBOL polcap 1872 112 M270
WINDOW 0 32 32 VTop 2
WINDOW 3 0 32 VBottom 2
SYMATTR InstName C76
SYMATTR Value 1500µ
SYMBOL polcap 1872 208 M270
WINDOW 0 32 32 VTop 2
WINDOW 3 0 32 VBottom 2
SYMATTR InstName C77
SYMATTR Value 1500µ
SYMBOL polcap 1872 304 M270
WINDOW 0 32 32 VTop 2
WINDOW 3 0 32 VBottom 2
SYMATTR InstName C78
SYMATTR Value 1500µ
SYMBOL polcap 1872 400 M270
WINDOW 0 32 32 VTop 2
WINDOW 3 0 32 VBottom 2
SYMATTR InstName C79
SYMATTR Value 1500µ
SYMBOL polcap 1872 496 M270
WINDOW 0 32 32 VTop 2
WINDOW 3 0 32 VBottom 2
SYMATTR InstName C80
SYMATTR Value 1500µ
SYMBOL polcap 1872 592 M270
WINDOW 0 32 32 VTop 2
WINDOW 3 0 32 VBottom 2
SYMATTR InstName C81
SYMATTR Value 1500µ
SYMBOL polcap 1872 688 M270
WINDOW 0 32 32 VTop 2
WINDOW 3 0 32 VBottom 2
SYMATTR InstName C82
SYMATTR Value 1500µ
SYMBOL polcap 1872 784 M270
WINDOW 0 32 32 VTop 2
WINDOW 3 0 32 VBottom 2
SYMATTR InstName C83
SYMATTR Value 1500µ
SYMBOL polcap 1872 880 M270
WINDOW 0 32 32 VTop 2
WINDOW 3 0 32 VBottom 2
SYMATTR InstName C84
SYMATTR Value 1500µ
SYMBOL polcap 1872 976 M270
WINDOW 0 32 32 VTop 2
WINDOW 3 0 32 VBottom 2
SYMATTR InstName C85
SYMATTR Value 1500µ
SYMBOL polcap 1872 1072 M270
WINDOW 0 32 32 VTop 2
WINDOW 3 0 32 VBottom 2
SYMATTR InstName C86
SYMATTR Value 1500µ
SYMBOL polcap 1872 1168 M270
WINDOW 0 32 32 VTop 2
WINDOW 3 0 32 VBottom 2
SYMATTR InstName C87
SYMATTR Value 1500µ
SYMBOL polcap 1872 1264 M270
WINDOW 0 32 32 VTop 2
WINDOW 3 0 32 VBottom 2
SYMATTR InstName C88
SYMATTR Value 1500µ
SYMBOL polcap 1872 1360 M270
WINDOW 0 32 32 VTop 2
WINDOW 3 0 32 VBottom 2
SYMATTR InstName C89
SYMATTR Value 1500µ
SYMBOL polcap 1872 1456 M270
WINDOW 0 32 32 VTop 2
WINDOW 3 0 32 VBottom 2
SYMATTR InstName C90
SYMATTR Value 1500µ
SYMBOL Res 1632 1536 R90
WINDOW 0 0 56 VBottom 2
WINDOW 3 32 56 VTop 2
SYMATTR InstName R17
SYMATTR Value 2k
SYMBOL Res 1632 1632 R90
WINDOW 0 0 56 VBottom 2
WINDOW 3 32 56 VTop 2
SYMATTR InstName R18
SYMATTR Value 2k
SYMBOL Diode 1488 1712 R0
SYMATTR InstName D9
SYMBOL Diode 1632 1712 R0
SYMATTR InstName D10
SYMBOL Res 1632 1840 R90
WINDOW 0 0 56 VBottom 2
WINDOW 3 32 56 VTop 2
SYMATTR InstName R19
SYMATTR Value 2k
SYMBOL Res 1632 1936 R90
WINDOW 0 0 56 VBottom 2
WINDOW 3 32 56 VTop 2
SYMATTR InstName R20
SYMATTR Value 2k
SYMBOL Res 1792 1968 R270
WINDOW 0 32 56 VTop 2
WINDOW 3 0 56 VBottom 2
SYMATTR InstName R21
SYMATTR Value 2k
SYMBOL Res 1792 1872 R270
WINDOW 0 32 56 VTop 2
WINDOW 3 0 56 VBottom 2
SYMATTR InstName R22
SYMATTR Value 2k
SYMBOL Diode 1936 1792 R180
WINDOW 0 24 64 Left 2
WINDOW 3 24 0 Left 2
SYMATTR InstName D11
SYMBOL Diode 1792 1792 R180
WINDOW 0 24 64 Left 2
WINDOW 3 24 0 Left 2
SYMATTR InstName D12
SYMBOL Res 1792 1664 R270
WINDOW 0 32 56 VTop 2
WINDOW 3 0 56 VBottom 2
SYMATTR InstName R23
SYMATTR Value 2k
SYMBOL Res 1792 1568 R270
WINDOW 0 32 56 VTop 2
WINDOW 3 0 56 VBottom 2
SYMATTR InstName R24
SYMATTR Value 2k
SYMBOL polcap 2256 112 R270
WINDOW 0 32 32 VTop 2
WINDOW 3 0 32 VBottom 2
SYMATTR InstName C91
SYMATTR Value 1500µ
SYMBOL polcap 2256 208 R270
WINDOW 0 32 32 VTop 2
WINDOW 3 0 32 VBottom 2
SYMATTR InstName C92
SYMATTR Value 1500µ
SYMBOL polcap 2256 304 R270
WINDOW 0 32 32 VTop 2
WINDOW 3 0 32 VBottom 2
SYMATTR InstName C93
SYMATTR Value 1500µ
SYMBOL polcap 2256 400 R270
WINDOW 0 32 32 VTop 2
WINDOW 3 0 32 VBottom 2
SYMATTR InstName C94
SYMATTR Value 1500µ
SYMBOL polcap 2256 496 R270
WINDOW 0 32 32 VTop 2
WINDOW 3 0 32 VBottom 2
SYMATTR InstName C95
SYMATTR Value 1500µ
SYMBOL polcap 2256 592 R270
WINDOW 0 32 32 VTop 2
WINDOW 3 0 32 VBottom 2
SYMATTR InstName C96
SYMATTR Value 1500µ
SYMBOL polcap 2256 688 R270
WINDOW 0 32 32 VTop 2
WINDOW 3 0 32 VBottom 2
SYMATTR InstName C97
SYMATTR Value 1500µ
SYMBOL polcap 2256 784 R270
WINDOW 0 32 32 VTop 2
WINDOW 3 0 32 VBottom 2
SYMATTR InstName C98
SYMATTR Value 1500µ
SYMBOL polcap 2256 880 R270
WINDOW 0 32 32 VTop 2
WINDOW 3 0 32 VBottom 2
SYMATTR InstName C99
SYMATTR Value 1500µ
SYMBOL polcap 2256 976 R270
WINDOW 0 32 32 VTop 2
WINDOW 3 0 32 VBottom 2
SYMATTR InstName C100
SYMATTR Value 1500µ
SYMBOL polcap 2256 1072 R270
WINDOW 0 32 32 VTop 2
WINDOW 3 0 32 VBottom 2
SYMATTR InstName C101
SYMATTR Value 1500µ
SYMBOL polcap 2256 1168 R270
WINDOW 0 32 32 VTop 2
WINDOW 3 0 32 VBottom 2
SYMATTR InstName C102
SYMATTR Value 1500µ
SYMBOL polcap 2256 1264 R270
WINDOW 0 32 32 VTop 2
WINDOW 3 0 32 VBottom 2
SYMATTR InstName C103
SYMATTR Value 1500µ
SYMBOL polcap 2256 1360 R270
WINDOW 0 32 32 VTop 2
WINDOW 3 0 32 VBottom 2
SYMATTR InstName C104
SYMATTR Value 1500µ
SYMBOL polcap 2256 1456 R270
WINDOW 0 32 32 VTop 2
WINDOW 3 0 32 VBottom 2
SYMATTR InstName C105
SYMATTR Value 1500µ
SYMBOL polcap 2592 112 M270
WINDOW 0 32 32 VTop 2
WINDOW 3 0 32 VBottom 2
SYMATTR InstName C106
SYMATTR Value 1500µ
SYMBOL polcap 2592 208 M270
WINDOW 0 32 32 VTop 2
WINDOW 3 0 32 VBottom 2
SYMATTR InstName C107
SYMATTR Value 1500µ
SYMBOL polcap 2592 304 M270
WINDOW 0 32 32 VTop 2
WINDOW 3 0 32 VBottom 2
SYMATTR InstName C108
SYMATTR Value 1500µ
SYMBOL polcap 2592 400 M270
WINDOW 0 32 32 VTop 2
WINDOW 3 0 32 VBottom 2
SYMATTR InstName C109
SYMATTR Value 1500µ
SYMBOL polcap 2592 496 M270
WINDOW 0 32 32 VTop 2
WINDOW 3 0 32 VBottom 2
SYMATTR InstName C110
SYMATTR Value 1500µ
SYMBOL polcap 2592 592 M270
WINDOW 0 32 32 VTop 2
WINDOW 3 0 32 VBottom 2
SYMATTR InstName C111
SYMATTR Value 1500µ
SYMBOL polcap 2592 688 M270
WINDOW 0 32 32 VTop 2
WINDOW 3 0 32 VBottom 2
SYMATTR InstName C112
SYMATTR Value 1500µ
SYMBOL polcap 2592 784 M270
WINDOW 0 32 32 VTop 2
WINDOW 3 0 32 VBottom 2
SYMATTR InstName C113
SYMATTR Value 1500µ
SYMBOL polcap 2592 880 M270
WINDOW 0 32 32 VTop 2
WINDOW 3 0 32 VBottom 2
SYMATTR InstName C114
SYMATTR Value 1500µ
SYMBOL polcap 2592 976 M270
WINDOW 0 32 32 VTop 2
WINDOW 3 0 32 VBottom 2
SYMATTR InstName C115
SYMATTR Value 1500µ
SYMBOL polcap 2592 1072 M270
WINDOW 0 32 32 VTop 2
WINDOW 3 0 32 VBottom 2
SYMATTR InstName C116
SYMATTR Value 1500µ
SYMBOL polcap 2592 1168 M270
WINDOW 0 32 32 VTop 2
WINDOW 3 0 32 VBottom 2
SYMATTR InstName C117
SYMATTR Value 1500µ
SYMBOL polcap 2592 1264 M270
WINDOW 0 32 32 VTop 2
WINDOW 3 0 32 VBottom 2
SYMATTR InstName C118
SYMATTR Value 1500µ
SYMBOL polcap 2592 1360 M270
WINDOW 0 32 32 VTop 2
WINDOW 3 0 32 VBottom 2
SYMATTR InstName C119
SYMATTR Value 1500µ
SYMBOL polcap 2592 1456 M270
WINDOW 0 32 32 VTop 2
WINDOW 3 0 32 VBottom 2
SYMATTR InstName C120
SYMATTR Value 1500µ
SYMBOL Res 2352 1536 R90
WINDOW 0 0 56 VBottom 2
WINDOW 3 32 56 VTop 2
SYMATTR InstName R25
SYMATTR Value 2k
SYMBOL Res 2352 1632 R90
WINDOW 0 0 56 VBottom 2
WINDOW 3 32 56 VTop 2
SYMATTR InstName R26
SYMATTR Value 2k
SYMBOL Diode 2208 1712 R0
SYMATTR InstName D13
SYMBOL Diode 2352 1712 R0
SYMATTR InstName D14
SYMBOL Res 2352 1840 R90
WINDOW 0 0 56 VBottom 2
WINDOW 3 32 56 VTop 2
SYMATTR InstName R27
SYMATTR Value 2k
SYMBOL Res 2352 1936 R90
WINDOW 0 0 56 VBottom 2
WINDOW 3 32 56 VTop 2
SYMATTR InstName R28
SYMATTR Value 2k
SYMBOL Res 2512 1968 R270
WINDOW 0 32 56 VTop 2
WINDOW 3 0 56 VBottom 2
SYMATTR InstName R29
SYMATTR Value 2k
SYMBOL Res 2512 1872 R270
WINDOW 0 32 56 VTop 2
WINDOW 3 0 56 VBottom 2
SYMATTR InstName R30
SYMATTR Value 2k
SYMBOL Diode 2656 1792 R180
WINDOW 0 24 64 Left 2
WINDOW 3 24 0 Left 2
SYMATTR InstName D15
SYMBOL Diode 2512 1792 R180
WINDOW 0 24 64 Left 2
WINDOW 3 24 0 Left 2
SYMATTR InstName D16
SYMBOL Res 2512 1664 R270
WINDOW 0 32 56 VTop 2
WINDOW 3 0 56 VBottom 2
SYMATTR InstName R31
SYMATTR Value 2k
SYMBOL Res 2512 1568 R270
WINDOW 0 32 56 VTop 2
WINDOW 3 0 56 VBottom 2
SYMATTR InstName R32
SYMATTR Value 2k
SYMBOL Res -112 1760 R0
SYMATTR InstName R33
SYMATTR Value 15
SYMBOL Res 512 1808 R0
SYMATTR InstName R34
SYMATTR Value 15
SYMBOL Res 624 1744 R0
SYMATTR InstName R35
SYMATTR Value 15
SYMBOL Res 1248 1808 R0
SYMATTR InstName R36
SYMATTR Value 15
SYMBOL Res 1360 1744 R0
SYMATTR InstName R37
SYMATTR Value 15
SYMBOL Res 1968 1808 R0
SYMATTR InstName R38
SYMATTR Value 15
SYMBOL Res 2080 1744 R0
SYMATTR InstName R39
SYMATTR Value 15
SYMBOL Res 2688 1808 R0
SYMATTR InstName R40
SYMATTR Value 15

The netlist it stands for:
* CapBank1_15CapSide_1to1.asc
C1 N002 N001 1500µ
C2 N002 N001 1500µ
C3 N002 N001 1500µ
C4 N002 N001 1500µ
C5 N002 N001 1500µ
C6 N002 N001 1500µ
C7 N002 N001 1500µ
C8 N002 N001 1500µ
C9 N002 N001 1500µ
C10 N002 N001 1500µ
C11 N002 N001 1500µ
C12 N002 N001 1500µ
C13 N002 N001 1500µ
C14 N002 N001 1500µ
C15 N002 N001 1500µ
C16 N003 N001 1500µ
C17 N003 N001 1500µ
C18 N003 N001 1500µ
C19 N003 N001 1500µ
C20 N003 N001 1500µ
C21 N003 N001 1500µ
C22 N003 N001 1500µ
C23 N003 N001 1500µ
C24 N003 N001 1500µ
C25 N003 N001 1500µ
C26 N003 N001 1500µ
C27 N003 N001 1500µ
C28 N003 N001 1500µ
C29 N003 N001 1500µ
C30 N003 N001 1500µ
R1 N010 Terminal9 2k
R2 N010 Terminal9 2k
D1 N010 N023 D
D2 N010 N002 D
R3 N023 Terminal9 2k
R4 N023 Terminal9 2k
R5 Terminal11 N019 2k
R6 Terminal11 N019 2k
D3 N019 N003 D
D4 N019 N011 D
R7 Terminal11 N011 2k
R8 Terminal11 N011 2k
C31 N004 N001 1500µ
C32 N004 N001 1500µ
C33 N004 N001 1500µ
C34 N004 N001 1500µ
C35 N004 N001 1500µ
C36 N004 N001 1500µ
C37 N004 N001 1500µ
C38 N004 N001 1500µ
C39 N004 N001 1500µ
C40 N004 N001 1500µ
C41 N004 N001 1500µ
C42 N004 N001 1500µ
C43 N004 N001 1500µ
C44 N004 N001 1500µ
C45 N004 N001 1500µ
C46 N005 N001 1500µ
C47 N005 N001 1500µ
C48 N005 N001 1500µ
C49 N005 N001 1500µ
C50 N005 N001 1500µ
C51 N005 N001 1500µ
C52 N005 N001 1500µ
C53 N005 N001 1500µ
C54 N005 N001 1500µ
C55 N005 N001 1500µ
C56 N005 N001 1500µ
C57 N005 N001 1500µ
C58 N005 N001 1500µ
C59 N005 N001 1500µ
C60 N005 N001 1500µ
R9 N012 Terminal9 2k
R10 N012 Terminal9 2k
D5 N012 N024 D
D6 N012 N004 D
R11 N024 Terminal9 2k
R12 N024 Terminal9 2k
R13 Terminal11 N020 2k
R14 Terminal11 N020 2k
D7 N020 N005 D
D8 N020 N013 D
R15 Terminal11 N013 2k
R16 Terminal11 N013 2k
C61 N006 N001 1500µ
C62 N006 N001 1500µ
C63 N006 N001 1500µ
C64 N006 N001 1500µ
C65 N006 N001 1500µ
C66 N006 N001 1500µ
C67 N006 N001 1500µ
C68 N006 N001 1500µ
C69 N006 N001 1500µ
C70 N006 N001 1500µ
C71 N006 N001 1500µ
C72 N006 N001 1500µ
C73 N006 N001 1500µ
C74 N006 N001 1500µ
C75 N006 N001 1500µ
C76 N007 N001 1500µ
C77 N007 N001 1500µ
C78 N007 N001 1500µ
C79 N007 N001 1500µ
C80 N007 N001 1500µ
C81 N007 N001 1500µ
C82 N007 N001 1500µ
C83 N007 N001 1500µ
C84 N007 N001 1500µ
C85 N007 N001 1500µ
C86 N007 N001 1500µ
C87 N007 N001 1500µ
C88 N007 N001 1500µ
C89 N007 N001 1500µ
C90 N007 N001 1500µ
R17 N014 Terminal9 2k
R18 N014 Terminal9 2k
D9 N014 N025 D
D10 N014 N006 D
R19 N025 Terminal9 2k
R20 N025 Terminal9 2k
R21 Terminal11 N021 2k
R22 Terminal11 N021 2k
D11 N021 N007 D
D12 N021 N015 D
R23 Terminal11 N015 2k
R24 Terminal11 N015 2k
C91 N008 N001 1500µ
C92 N008 N001 1500µ
C93 N008 N001 1500µ
C94 N008 N001 1500µ
C95 N008 N001 1500µ
C96 N008 N001 1500µ
C97 N008 N001 1500µ
C98 N008 N001 1500µ
C99 N008 N001 1500µ
C100 N008 N001 1500µ
C101 N008 N001 1500µ
C102 N008 N001 1500µ
C103 N008 N001 1500µ
C104 N008 N001 1500µ
C105 N008 N001 1500µ
C106 N009 N001 1500µ
C107 N009 N001 1500µ
C108 N009 N001 1500µ
C109 N009 N001 1500µ
C110 N009 N001 1500µ
C111 N009 N001 1500µ
C112 N009 N001 1500µ
C113 N009 N001 1500µ
C114 N009 N001 1500µ
C115 N009 N001 1500µ
C116 N009 N001 1500µ
C117 N009 N001 1500µ
C118 N009 N001 1500µ
C119 N009 N001 1500µ
C120 N009 N001 1500µ
R25 N016 Terminal9 2k
R26 N016 Terminal9 2k
D13 N018 N026 D
D14 N018 N008 D
R27 N026 Terminal9 2k
R28 N026 Terminal9 2k
R29 Terminal11 N022 2k
R30 Terminal11 N022 2k
D15 N022 N009 D
D16 N022 N017 D
R31 Terminal11 N017 2k
R32 Terminal11 N017 2k
R33 N010 N027 15
R34 N019 N027 15
R35 N012 N027 15
R36 N020 N027 15
R37 N014 N027 15
R38 N021 N027 15
R39 N018 N027 15
R40 N022 N027 15
.model D D
.lib standard.dio
.backanno
.end